# EAGLE schematic Main (EAGLE 7.6.0)

## Sheet 1 of 2
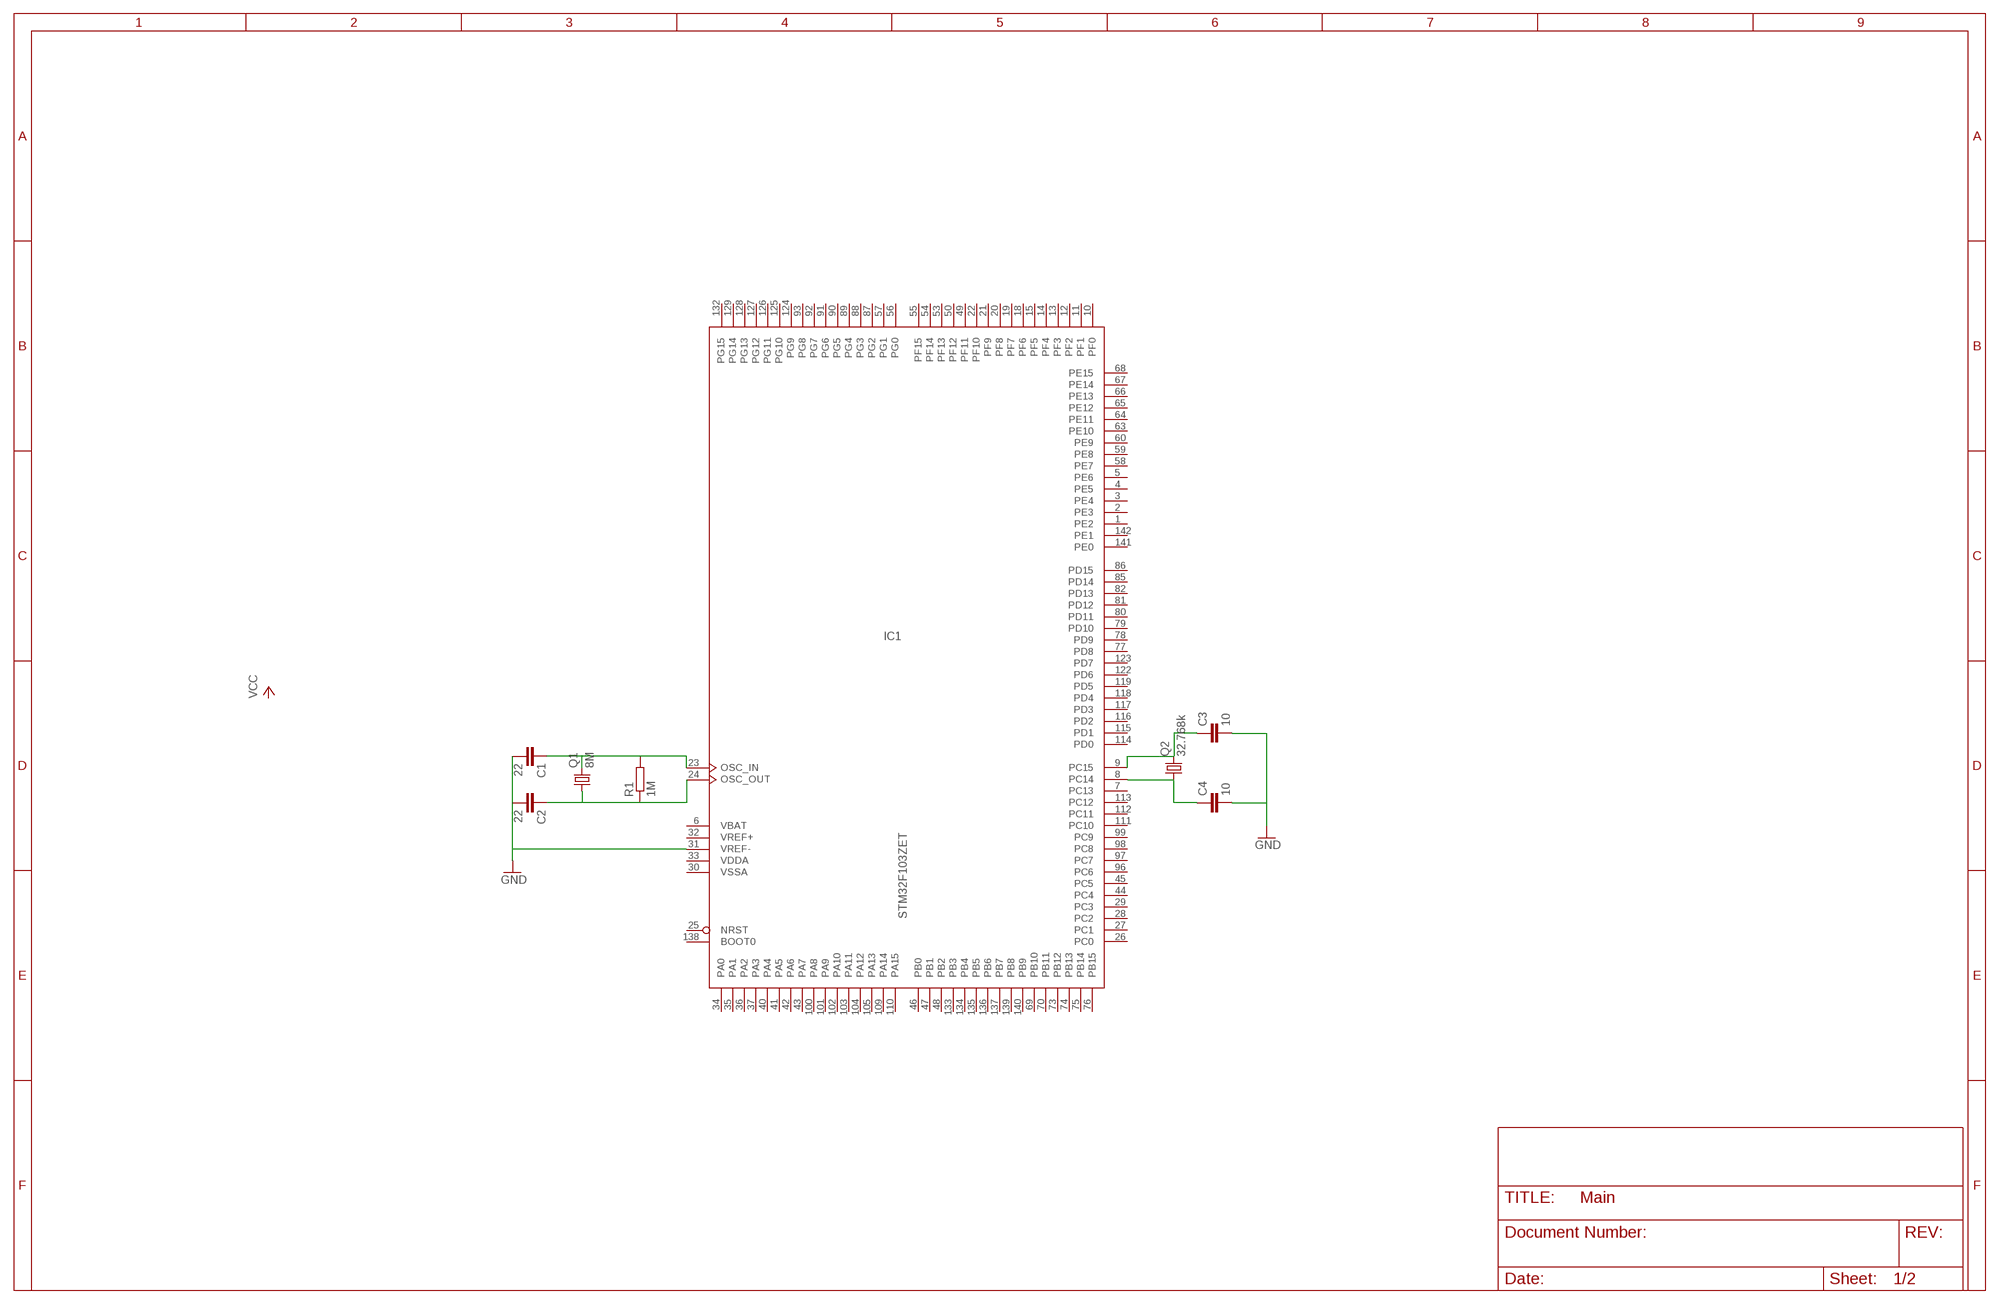
[diagram p0: schematic, sheet 1]

### Parts
C1  22  C-EUC0603  [C0603]
C2  22  C-EUC0603  [C0603]
C3  10  C-EUC0603  [C0603]
C4  10  C-EUC0603  [C0603]
IC1  STM32F103ZET  [LQFP144]
Q1  8M  CRYSTALHC49UP  [HC49UP]
Q2  32.768k  CRYSTALHC49UP  [HC49UP]
R1  1M  R-EU_R0603  [R0603]

### Nets
GND: C1.2 C2.2 C3.2 C4.2 IC1.31(VREF-) ; also sheet 2
N$1: C1.1 IC1.23(OSC_IN) Q1.2 R1.2
N$2: C2.1 IC1.24(OSC_OUT) Q1.1 R1.1
N$4: C4.1 IC1.8(PC14) Q2.1
N$5: C3.1 IC1.9(PC15) Q2.2
Unconnected: IC1.1(PE2) IC1.2(PE3) IC1.3(PE4) IC1.4(PE5) IC1.5(PE6) IC1.7(PC13) IC1.10(PF0) IC1.11(PF1) IC1.12(PF2) IC1.13(PF3) IC1.14(PF4) IC1.15(PF5) IC1.18(PF6) IC1.19(PF7) IC1.20(PF8) IC1.21(PF9) IC1.22(PF10) IC1.25(NRST) IC1.26(PC0) IC1.27(PC1) IC1.28(PC2) IC1.29(PC3) IC1.34(PA0) IC1.35(PA1) IC1.36(PA2) IC1.37(PA3) IC1.40(PA4) IC1.41(PA5) IC1.42(PA6) IC1.43(PA7) IC1.44(PC4) IC1.45(PC5) IC1.46(PB0) IC1.47(PB1) IC1.48(PB2) IC1.49(PF11) IC1.50(PF12) IC1.53(PF13) IC1.54(PF14) IC1.55(PF15) IC1.56(PG0) IC1.57(PG1) IC1.58(PE7) IC1.59(PE8) IC1.60(PE9) IC1.63(PE10) IC1.64(PE11) IC1.65(PE12) IC1.66(PE13) IC1.67(PE14) IC1.68(PE15) IC1.69(PB10) IC1.70(PB11) IC1.73(PB12) IC1.74(PB13) IC1.75(PB14) IC1.76(PB15) IC1.77(PD8) IC1.78(PD9) IC1.79(PD10) IC1.80(PD11) IC1.81(PD12) IC1.82(PD13) IC1.85(PD14) IC1.86(PD15) IC1.87(PG2) IC1.88(PG3) IC1.89(PG4) IC1.90(PG5) IC1.91(PG6) IC1.92(PG7) IC1.93(PG8) IC1.96(PC6) IC1.97(PC7) IC1.98(PC8) IC1.99(PC9) IC1.100(PA8) IC1.101(PA9) IC1.102(PA10) IC1.103(PA11) IC1.104(PA12) IC1.105(PA13) IC1.109(PA14) IC1.110(PA15) IC1.111(PC10) IC1.112(PC11) IC1.113(PC12) IC1.114(PD0) IC1.115(PD1) IC1.116(PD2) IC1.117(PD3) IC1.118(PD4) IC1.119(PD5) IC1.122(PD6) IC1.123(PD7) IC1.124(PG9) IC1.125(PG10) IC1.126(PG11) IC1.127(PG12) IC1.128(PG13) IC1.129(PG14) IC1.132(PG15) IC1.133(PB3) IC1.134(PB4) IC1.135(PB5) IC1.136(PB6) IC1.137(PB7) IC1.138(BOOT0) IC1.139(PB8) IC1.140(PB9) IC1.141(PE0) IC1.142(PE1)

## Sheet 2 of 2
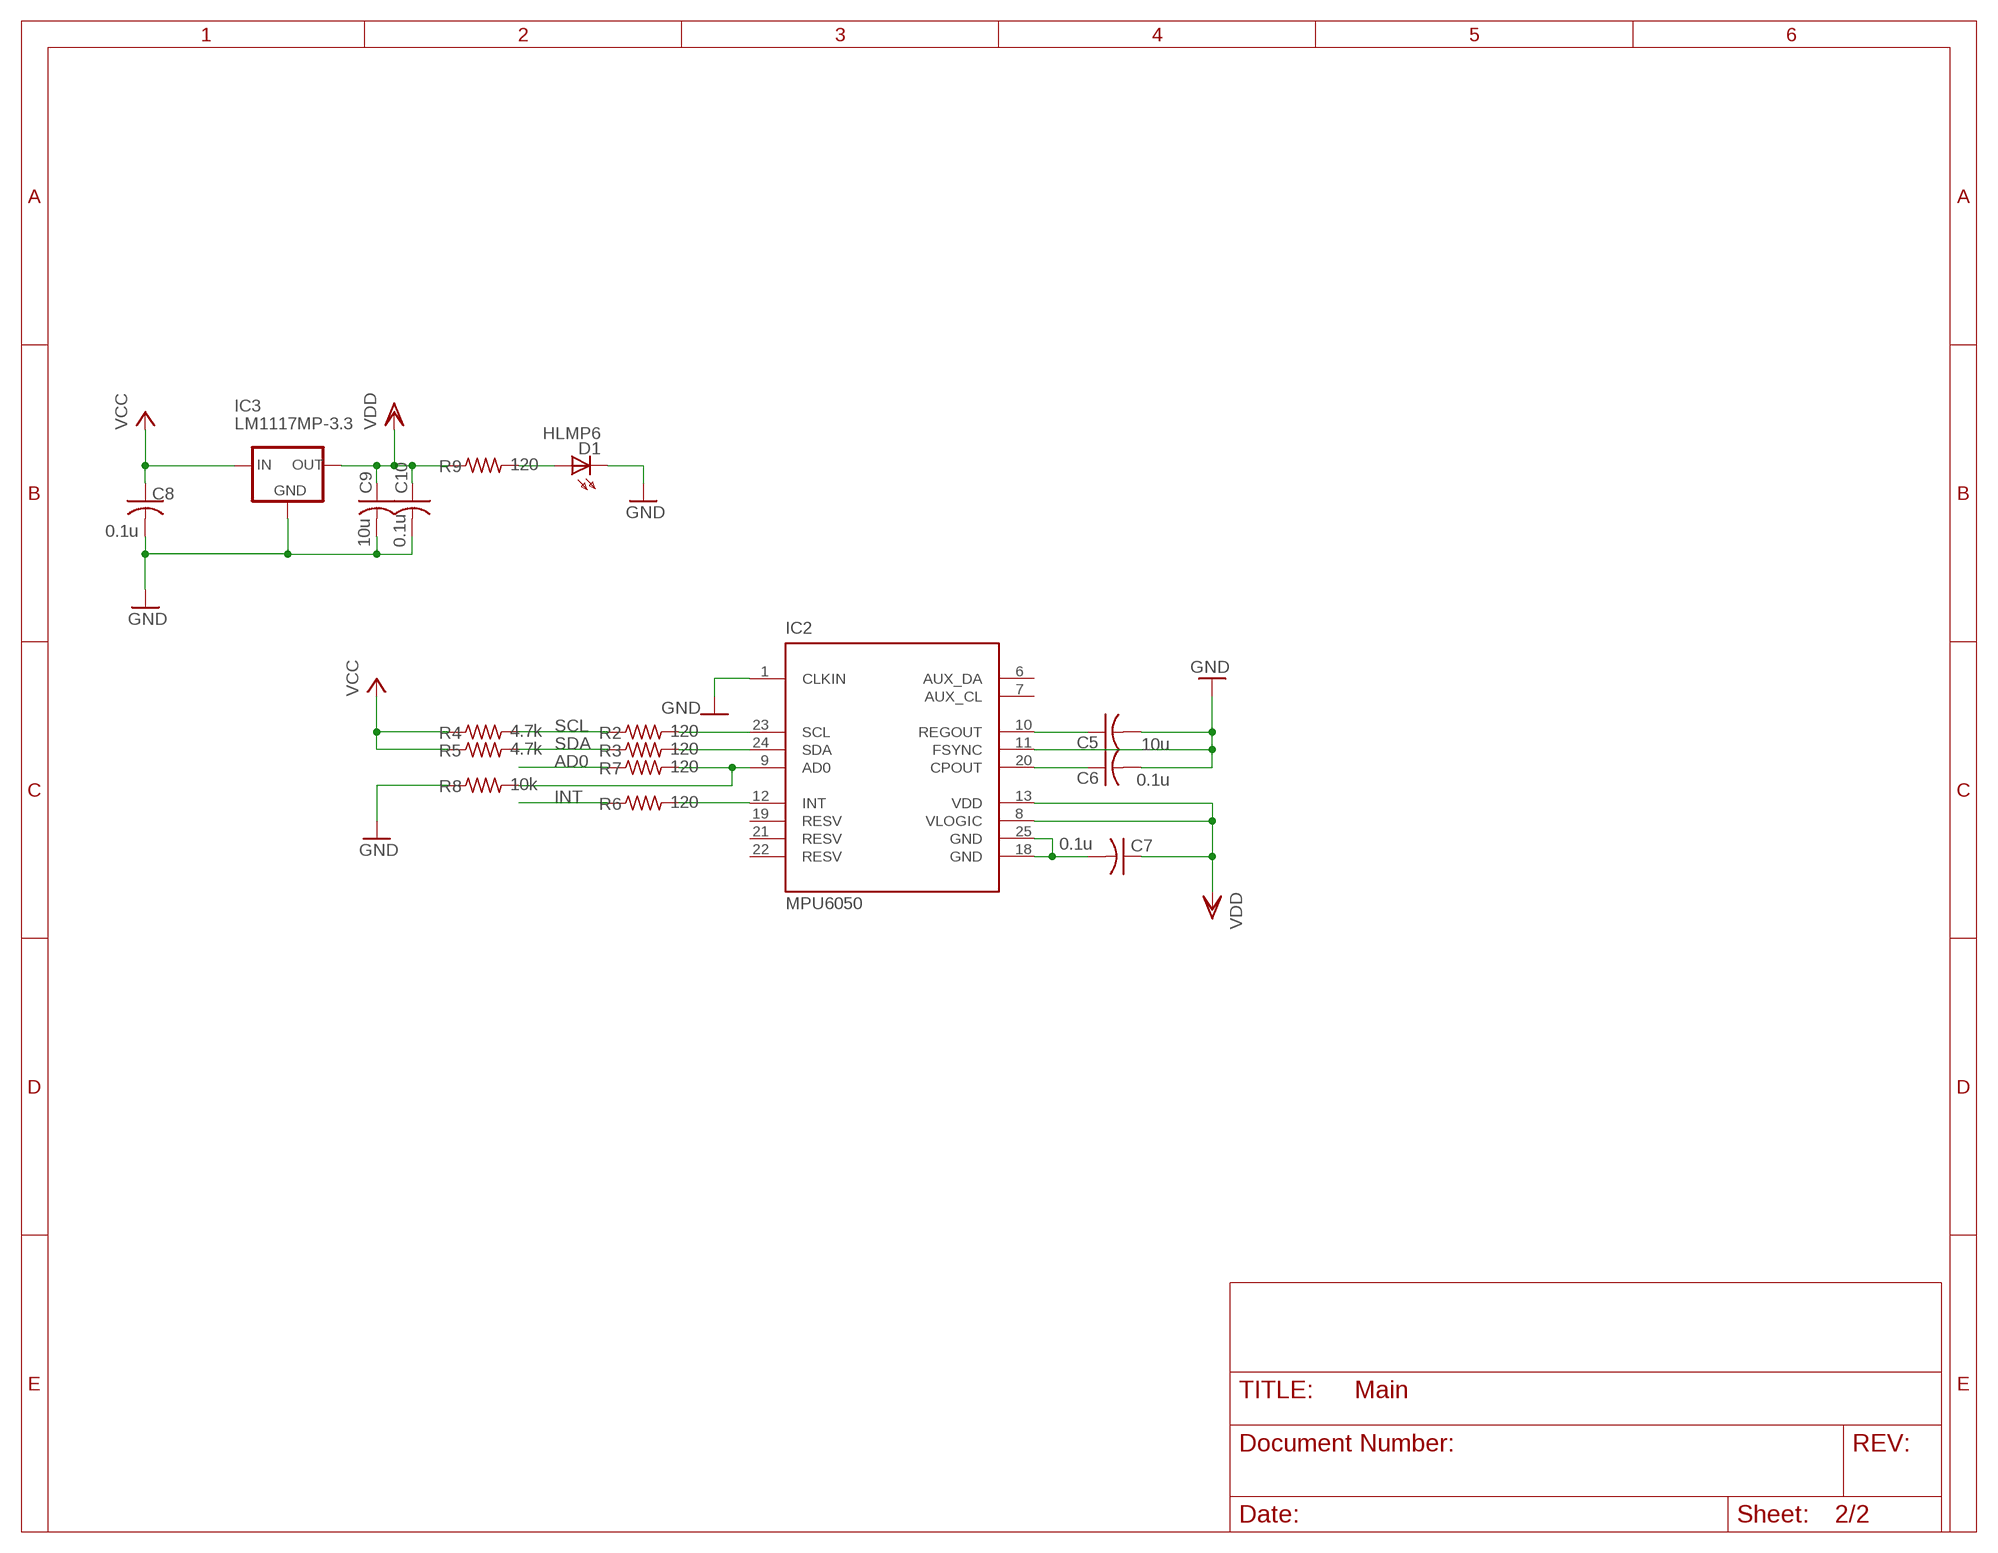
[diagram p1: schematic, sheet 2]

### Parts
C5  10u  C-USC0603  [C0603]
C6  0.1u  C-USC0603  [C0603]
C7  0.1u  C-USC0603  [C0603]
C8  0.1u  C-USC0603  [C0603]
C9  10u  C-USC0603  [C0603]
C10  0.1u  C-USC0603  [C0603]
D1  HLMP6  [HLMP6]
IC2  MPU6050  [QFN50P400X400X95-25T265X275N]
IC3  LM1117MP-3.3  [SOT223]
R2  120  R-US_R0603  [R0603]
R3  120  R-US_R0603  [R0603]
R4  4.7k  R-US_R0603  [R0603]
R5  4.7k  R-US_R0603  [R0603]
R6  120  R-US_R0603  [R0603]
R7  120  R-US_R0603  [R0603]
R8  10k  R-US_R0603  [R0603]
R9  120  R-US_R0603  [R0603]

### Nets
AD0: R7.1
GND: C5.2 C6.2 C8.2 C9.2 C10.2 D1.K IC2.1(CLKIN) IC2.11(FSYNC) IC3.1(GND) R8.1 ; also sheet 1
INT: R6.1
N$3: IC2.23(SCL) R2.2
N$6: IC2.24(SDA) R3.2
N$7: C5.1 IC2.10(REGOUT)
N$8: IC2.12(INT) R6.2
N$9: C6.1 IC2.20(CPOUT)
N$11: D1.A R9.2
N$12: C7.2 IC2.18(GND) IC2.25(GND)
N$13: IC2.9(AD0) R7.2 R8.2
SCL: R2.1 R4.2
SDA: R3.1 R5.2
VCC: C8.1 IC3.3(IN) R4.1 R5.1
VDD: C7.1 C9.1 C10.1 IC2.8(VLOGIC) IC2.13(VDD) IC3.2(OUT) IC3.4(OUT) R9.1
Unconnected: IC2.2(NC) IC2.3(NC) IC2.4(NC) IC2.5(NC) IC2.6(AUX_DA) IC2.7(AUX_CL) IC2.14(NC) IC2.15(NC) IC2.16(NC) IC2.17(NC) IC2.19(RESV) IC2.21(RESV) IC2.22(RESV)

## Power pins joined to a net without a drawn wire
VBAT: IC1.6(VBAT)
VDD: IC1.17(VDD) IC1.39(VDD) IC1.52(VDD) IC1.62(VDD) IC1.72(VDD) IC1.84(VDD) IC1.95(VDD) IC1.108(VDD) IC1.121(VDD) IC1.131(VDD) IC1.144(VDD)
VDDA: IC1.33(VDDA)
VREF+: IC1.32(VREF+)
VSS: IC1.16(VSS) IC1.38(VSS) IC1.51(VSS) IC1.61(VSS) IC1.71(VSS) IC1.83(VSS) IC1.94(VSS) IC1.107(VSS) IC1.120(VSS) IC1.130(VSS) IC1.143(VSS)
VSSA: IC1.30(VSSA)

## Library data of the parts
C1-C4 = rcl:C-EU: CAPACITOR, European symbol
C5-C10 = rcl:C-US: CAPACITOR, American symbol
D1 = display-hp:HLMP6: LED 2mm horizontal; MF: AGILENT TECHNOLOGIES; MPN: HLMP-6500; OC_FARNELL: 1652490; OC_NEWARK: 40K0088
IC1 = micro-stm_v3:STM32F103Z*T: ARM 32-bit Cortex™-M3 CPU 72 MHz maximum frequency 256 to 1024 Kbytes of Flash memory 48 to 96 kbytes of SRAM 112 GPIOs 2.0 to 3.6 V application supply
IC2 = invensense:MPU6050: The triple-axis MEMS gyroscope
IC3 = lm1117_11:LM1117?-*: 800mA Low-Dropout Linear Regulator Source: http://www.ti.com/lit/ds/symlink/lm1117-n.pdf; MF: Texas Instruments; MPN: LM1117MP-3.3; OC_FARNELL: 9778195; OC_NEWARK: 28X3416
Q1 Q2 = crystal:CRYSTAL: CRYSTAL; OC_FARNELL: unknown; OC_NEWARK: unknown
R1 = resistor:R-EU_: RESISTOR, European symbol
R2-R9 = rcl:R-US_: RESISTOR, American symbol